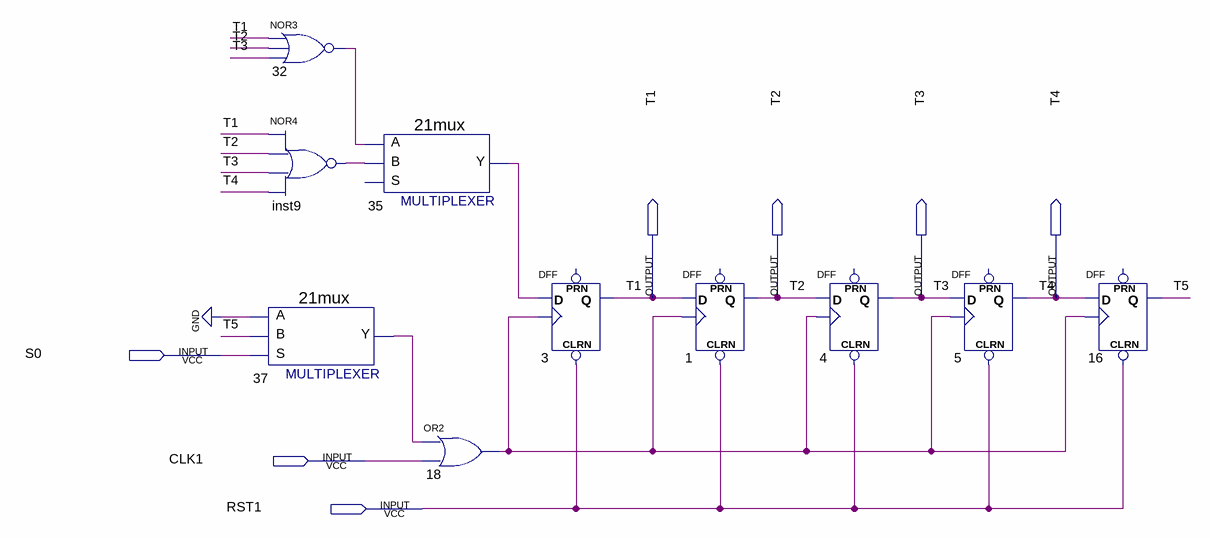
[diagram p0: schematic sheet]
// Quartus schematic prj05.bdf as structural Verilog: 10 symbols, 7 pins
module prj05 (
  input  S0,
  input  CLK1,
  input  RST1,
  output T1,
  output T2,
  output T3,
  output T4
);

  wire inst9_out, n18_out, n32_out, n35_y, n37_y, T5;

  nor u_32 (n32_out, T1, T2, T3);
  nor inst9 (inst9_out, T1, T2, T3, T4);
  \21mux  u_37 (.S(S0), .B(T5), .A(1'b0), .Y(n37_y));
  \21mux  u_35 (.B(inst9_out), .A(n32_out), .Y(n35_y));  // open: S
  or u_18 (n18_out, n37_y, CLK1);
  DFF u_3 (.CLRN(RST1), .CLK(n18_out), .D(n35_y), .Q(T1));  // open: PRN
  DFF u_1 (.CLRN(RST1), .CLK(n18_out), .D(T1), .Q(T2));  // open: PRN
  DFF u_4 (.CLRN(RST1), .CLK(n18_out), .D(T2), .Q(T3));  // open: PRN
  DFF u_5 (.CLRN(RST1), .CLK(n18_out), .D(T3), .Q(T4));  // open: PRN
  DFF u_16 (.CLRN(RST1), .CLK(n18_out), .D(T4), .Q(T5));  // open: PRN
endmodule
